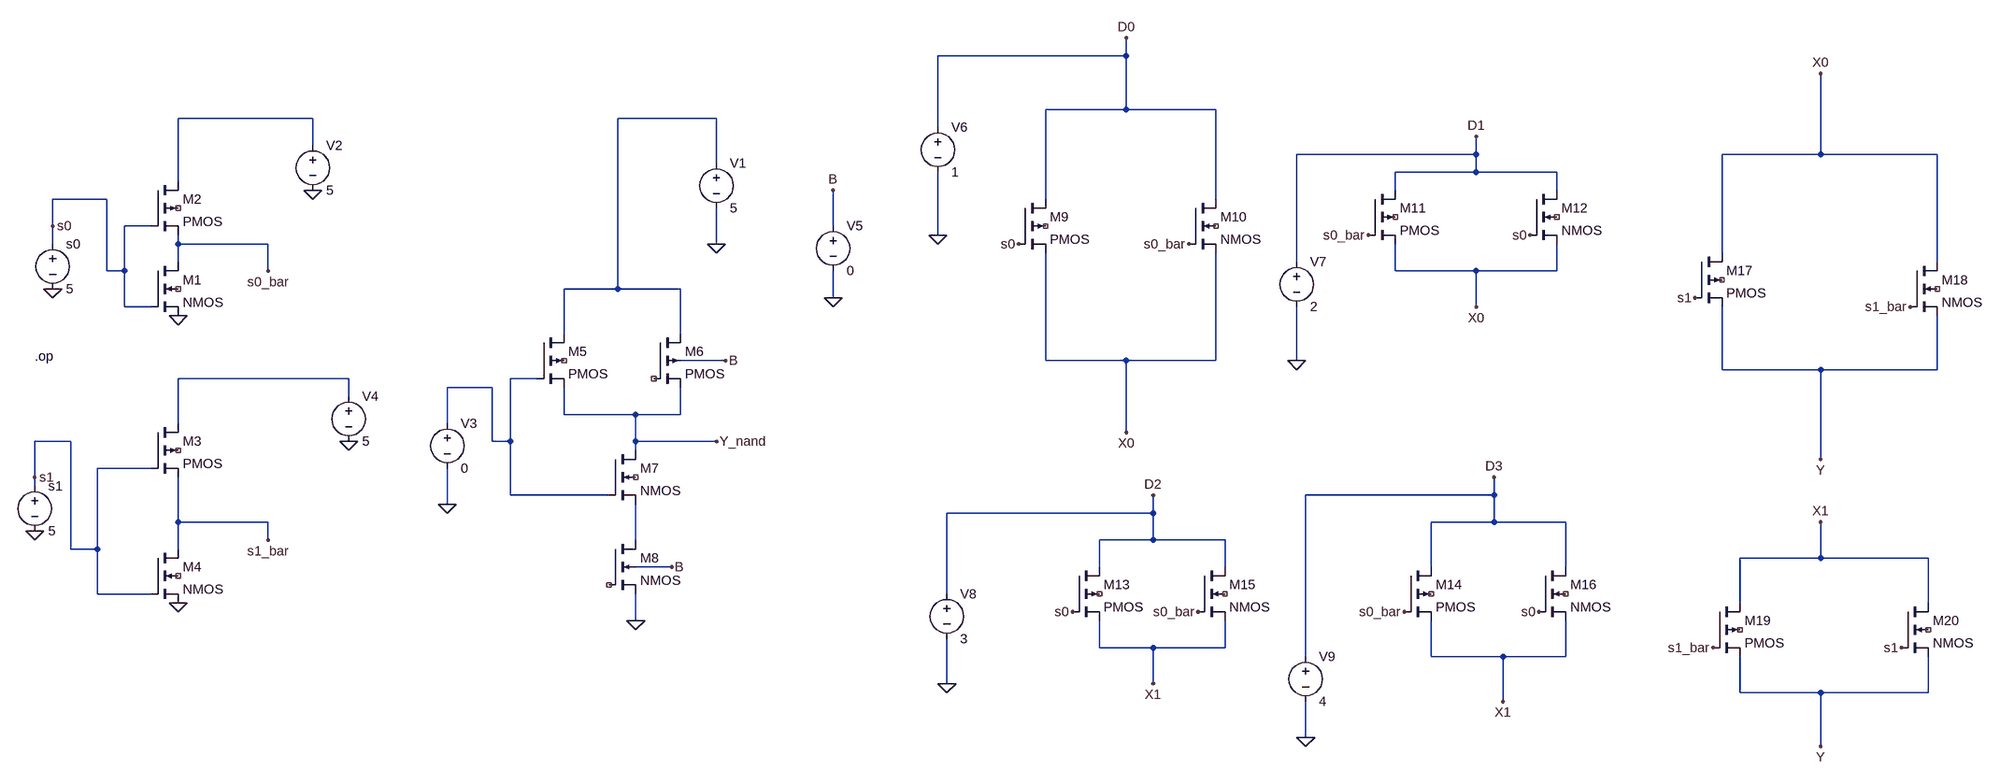
[diagram p0: schematic Mux_4_1.asc]
Mux_4_1.asc, the LTspice schematic file:
Version 4.1
SHEET 1 4228 1292
WIRE 1872 -208 1872 -240
WIRE 1872 -208 1536 -208
WIRE 1872 -112 1872 -208
WIRE 1872 -112 1728 -112
WIRE 2032 -112 1872 -112
WIRE 416 -96 176 -96
WIRE 1136 -96 960 -96
WIRE 1536 -80 1536 -208
WIRE 416 -48 416 -96
WIRE 2496 -32 2496 -64
WIRE 2496 -32 2176 -32
WIRE 3184 -32 3184 -176
WIRE 3184 -32 3008 -32
WIRE 3392 -32 3184 -32
WIRE 1136 -16 1136 -96
WIRE 2496 0 2496 -32
WIRE 2496 0 2352 0
WIRE 2640 0 2496 0
WIRE 176 16 176 -96
WIRE 2352 32 2352 0
WIRE 2640 32 2640 0
WIRE 48 48 -48 48
WIRE 1728 48 1728 -112
WIRE 2032 48 2032 -112
WIRE -48 96 -48 48
WIRE 128 96 80 96
WIRE 1344 96 1344 32
WIRE 1536 112 1536 0
WIRE -48 128 -48 96
WIRE 176 128 176 112
WIRE 336 128 176 128
WIRE 1136 128 1136 64
WIRE 3008 144 3008 -32
WIRE 176 160 176 128
WIRE 2176 160 2176 -32
WIRE 3392 160 3392 -32
WIRE 48 176 48 48
WIRE 80 176 80 96
WIRE 80 176 48 176
WIRE 336 176 336 128
WIRE 2352 176 2352 128
WIRE 2496 176 2352 176
WIRE 2640 176 2640 128
WIRE 2640 176 2496 176
WIRE 960 208 960 -96
WIRE 960 208 864 208
WIRE 1072 208 960 208
WIRE 1344 224 1344 176
WIRE 80 240 80 176
WIRE 128 240 80 240
WIRE 2496 240 2496 176
WIRE 864 288 864 208
WIRE 1072 288 1072 208
WIRE 1152 336 1072 336
WIRE 1728 336 1728 144
WIRE 1872 336 1728 336
WIRE 2032 336 2032 144
WIRE 2032 336 1872 336
WIRE 2176 336 2176 240
WIRE 3008 352 3008 240
WIRE 3184 352 3008 352
WIRE 3392 352 3392 256
WIRE 3392 352 3184 352
WIRE 480 368 176 368
WIRE 816 368 768 368
WIRE 736 384 656 384
WIRE 480 400 480 368
WIRE 864 432 864 384
WIRE 992 432 864 432
WIRE 1072 432 1072 384
WIRE 1072 432 992 432
WIRE 176 448 176 368
WIRE 656 448 656 384
WIRE 1872 464 1872 336
WIRE -16 480 -80 480
WIRE 736 480 736 384
WIRE 768 480 768 368
WIRE 768 480 736 480
WIRE 992 480 992 432
WIRE 1136 480 992 480
WIRE 992 496 992 480
WIRE 3184 512 3184 352
WIRE 128 528 32 528
WIRE -80 544 -80 480
WIRE -80 560 -80 544
WIRE 768 576 768 480
WIRE 944 576 768 576
WIRE 2528 576 2528 544
WIRE 2528 576 2192 576
WIRE 656 592 656 528
WIRE 1920 608 1920 576
WIRE 1920 608 1552 608
WIRE 176 624 176 544
WIRE 336 624 176 624
WIRE 2528 624 2528 576
WIRE 2528 624 2416 624
WIRE 2656 624 2528 624
WIRE 336 656 336 624
WIRE 992 656 992 592
WIRE 1920 656 1920 608
WIRE 1920 656 1824 656
WIRE 2048 656 1920 656
WIRE -16 672 -16 480
WIRE 32 672 32 528
WIRE 32 672 -16 672
WIRE 176 672 176 624
WIRE 3184 688 3184 624
WIRE 3184 688 3040 688
WIRE 3376 688 3184 688
WIRE 1056 704 992 704
WIRE 1824 704 1824 656
WIRE 2048 704 2048 656
WIRE 2416 704 2416 624
WIRE 2656 704 2656 624
WIRE 32 752 32 672
WIRE 128 752 32 752
WIRE 1552 752 1552 608
WIRE 3040 768 3040 688
WIRE 3376 768 3376 688
WIRE 992 800 992 752
WIRE 1824 848 1824 800
WIRE 1920 848 1824 848
WIRE 2048 848 2048 800
WIRE 2048 848 1920 848
WIRE 2192 864 2192 576
WIRE 2416 864 2416 800
WIRE 2544 864 2416 864
WIRE 2656 864 2656 800
WIRE 2656 864 2544 864
WIRE 1552 912 1552 832
WIRE 1920 912 1920 848
WIRE 3040 928 3040 864
WIRE 3184 928 3040 928
WIRE 3376 928 3376 864
WIRE 3376 928 3184 928
WIRE 2544 944 2544 864
WIRE 2192 1008 2192 944
WIRE 3184 1024 3184 928
FLAG 336 176 s0_bar
FLAG 336 656 s1_bar
FLAG 992 800 0
FLAG 1344 224 0
FLAG 656 592 0
FLAG 1136 128 0
FLAG 1136 480 Y_nand
FLAG 1344 32 B
FLAG 1152 336 B
FLAG 1056 704 B
FLAG 1872 -240 D0
FLAG 1872 464 X0
FLAG 1680 128 s0
FLAG 1984 128 s0_bar
FLAG 1536 112 0
FLAG 2496 -64 D1
FLAG 2496 240 X0
FLAG 2176 336 0
FLAG 2592 112 s0
FLAG 2304 112 s0_bar
FLAG 1920 576 D2
FLAG 1920 912 X1
FLAG 2528 544 D3
FLAG 2544 944 X1
FLAG 1776 784 s0
FLAG 2000 784 s0_bar
FLAG 2368 784 s0_bar
FLAG 2608 784 s0
FLAG 3184 -176 X0
FLAG 3184 512 Y
FLAG 2960 224 s1
FLAG 3344 240 s1_bar
FLAG 3184 624 X1
FLAG 3184 1024 Y
FLAG 2992 848 s1_bar
FLAG 3328 848 s1
FLAG 1552 912 0
FLAG 2192 1008 0
FLAG 176 256 0
FLAG 176 768 0
FLAG 480 480 0
FLAG 416 32 0
FLAG -80 640 0
FLAG -48 208 0
FLAG -48 96 s0
FLAG -80 544 s1
DATAFLAG 1200 560 ""
SYMBOL nmos4 128 160 R0
SYMATTR InstName M1
SYMBOL pmos4 128 16 R0
SYMATTR InstName M2
SYMBOL voltage 416 -64 R0
WINDOW 123 0 0 Left 0
WINDOW 39 0 0 Left 0
SYMATTR InstName V2
SYMATTR Value 5
SYMBOL pmos4 128 448 R0
SYMATTR InstName M3
SYMBOL nmos4 128 672 R0
SYMATTR InstName M4
SYMBOL voltage -80 544 R0
WINDOW 123 0 0 Left 0
WINDOW 39 0 0 Left 0
SYMATTR InstName s1
SYMATTR Value 5
SYMBOL voltage 480 384 R0
WINDOW 123 0 0 Left 0
WINDOW 39 0 0 Left 0
SYMATTR InstName V4
SYMATTR Value 5
SYMBOL pmos4 816 288 R0
SYMATTR InstName M5
SYMBOL nmos4 944 656 R0
SYMATTR InstName M8
SYMBOL voltage 1136 -32 R0
WINDOW 123 0 0 Left 0
WINDOW 39 0 0 Left 0
SYMATTR InstName V1
SYMATTR Value 5
SYMBOL pmos4 1024 288 R0
SYMATTR InstName M6
SYMBOL nmos4 944 496 R0
SYMATTR InstName M7
SYMBOL voltage 656 432 R0
WINDOW 123 0 0 Left 0
WINDOW 39 0 0 Left 0
SYMATTR InstName V3
SYMATTR Value 0
SYMBOL voltage 1344 80 R0
WINDOW 123 0 0 Left 0
WINDOW 39 0 0 Left 0
SYMATTR InstName V5
SYMATTR Value 0
SYMBOL pmos4 1680 48 R0
SYMATTR InstName M9
SYMBOL nmos4 1984 48 R0
SYMATTR InstName M10
SYMBOL voltage 1536 -96 R0
WINDOW 123 0 0 Left 0
WINDOW 39 0 0 Left 0
SYMATTR InstName V6
SYMATTR Value 1
SYMBOL pmos4 2304 32 R0
SYMATTR InstName M11
SYMBOL nmos4 2592 32 R0
SYMATTR InstName M12
SYMBOL voltage 2176 144 R0
WINDOW 123 0 0 Left 0
WINDOW 39 0 0 Left 0
SYMATTR InstName V7
SYMATTR Value 2
SYMBOL pmos4 1776 704 R0
SYMATTR InstName M13
SYMBOL pmos4 2368 704 R0
SYMATTR InstName M14
SYMBOL nmos4 2000 704 R0
SYMATTR InstName M15
SYMBOL nmos4 2608 704 R0
SYMATTR InstName M16
SYMBOL pmos4 2960 144 R0
SYMATTR InstName M17
SYMBOL nmos4 3344 160 R0
SYMATTR InstName M18
SYMBOL pmos4 2992 768 R0
SYMATTR InstName M19
SYMBOL nmos4 3328 768 R0
SYMATTR InstName M20
SYMBOL voltage 1552 736 R0
WINDOW 123 0 0 Left 0
WINDOW 39 0 0 Left 0
SYMATTR InstName V8
SYMATTR Value 3
SYMBOL voltage 2192 848 R0
WINDOW 123 0 0 Left 0
WINDOW 39 0 0 Left 0
SYMATTR InstName V9
SYMATTR Value 4
SYMBOL voltage -48 112 R0
WINDOW 123 0 0 Left 0
WINDOW 39 0 0 Left 0
SYMATTR InstName s0
SYMATTR Value 5
TEXT -80 328 Left 2 !.op

The netlist it stands for:
* Mux_4_1.asc
M1 s0_bar s0 0 NC_01 NMOS
M2 N001 s0 s0_bar NC_02 PMOS
V2 N001 0 5
M3 N003 s1 s1_bar NC_03 PMOS
M4 s1_bar s1 0 NC_04 NMOS
V§s1 s1 0 5
V4 N003 0 5
M5 N002 N004 Y_nand NC_05 PMOS
M8 N005 NC_06 0 B NMOS
V1 N002 0 5
M6 N002 NC_07 Y_nand B PMOS
M7 Y_nand N004 N005 NC_08 NMOS
V3 N004 0 0
V5 B 0 0
M9 D0 s0 X0 NC_09 PMOS
M10 D0 s0_bar X0 NC_10 NMOS
V6 D0 0 1
M11 D1 s0_bar X0 NC_11 PMOS
M12 D1 s0 X0 NC_12 NMOS
V7 D1 0 2
M13 D2 s0 X1 NC_13 PMOS
M14 D3 s0_bar X1 NC_14 PMOS
M15 D2 s0_bar X1 NC_15 NMOS
M16 D3 s0 X1 NC_16 NMOS
M17 X0 s1 Y NC_17 PMOS
M18 X0 s1_bar Y NC_18 NMOS
M19 X1 s1_bar Y NC_19 PMOS
M20 X1 s1 Y NC_20 NMOS
V8 D2 0 3
V9 D3 0 4
V§s0 s0 0 5
.model NMOS NMOS
.model PMOS PMOS
.lib standard.mos
.op
.backanno
.end